# Altium schematic sheet adapter.SchDoc: DiPho_adapter
size 420 x 297 mm; Author: P.Daniel; CompanyName: WUT ISE; DrawnBy: P.Daniel; Organization: WUT ISE; Address1: PW ISE; Address2: Nowowiejska 15/19 00-665 Warsaw; Address3: piotrmaciejdaniel@gmail.com; Revision: 2; SheetNumber: 1; SheetTotal: 1; ModifiedBy: -; CheckedDate: -; Title2: adapter board for DiPho sensor; DivGrp: WUT ISE; Designer: Piotr Daniel; ModifiedDate: -; ProjectName: Sensor Box
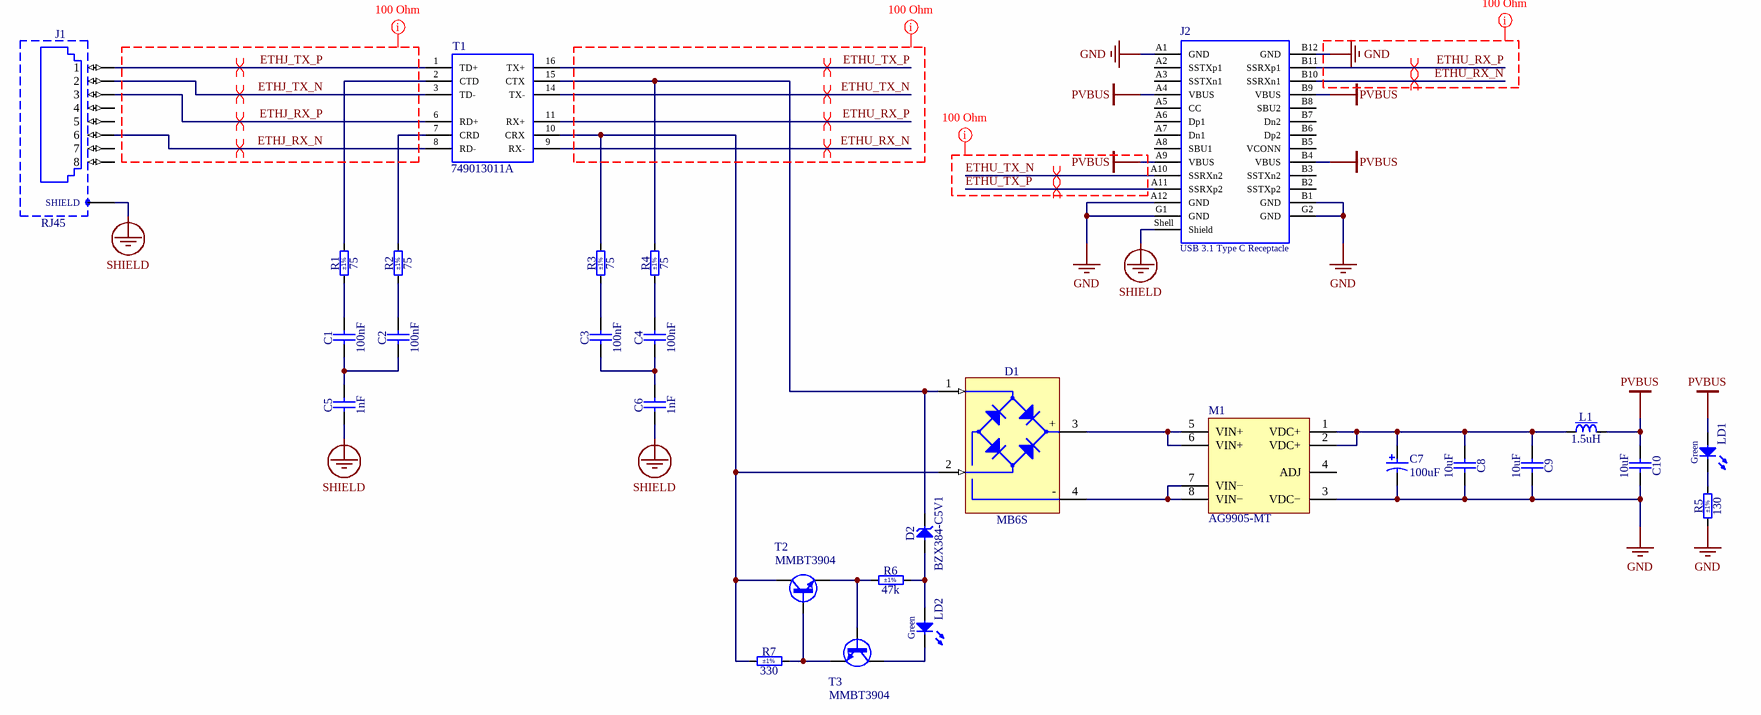
[diagram p0: adapter.SchDoc]

## Parts
C1  100nF  [CAPC1608X90N]
C2  100nF  [CAPC1608X90N]
C3  100nF  [CAPC1608X90N]
C4  100nF  [CAPC1608X90N]
C5  1nF  [CAPC3216X180N]
C6  1nF  [CAPC3216X180N]
C7  100uF  [PNSC-EEEFK1C101P_L]
C8  10uF  [CAPC3225X270N]
C9  10uF  [CAPC3225X270N]
C10  10uF  [CAPC3225X270N]
D1  MB6S  [SOIC254P665X290-4N]
D2  BZX384-C5V1  [SOD2512X110N]
J1  RJ45  [MOLEX_44661-1001]
J2  USB 3.1 Type C Receptacle  [632723300011]
L1  1.5uH  [IND_COILCRAFT_1812CS]
LD1  Green  [LED_LITEON_LTST-C193KGKT-5A]
LD2  Green  [LED_LITEON_LTST-C193KGKT-5A]
M1  AG9905-MT  [SILVERTEL_AG9900]
R1  75  Tolerance: ±1%  [RESC1608X55N]
R2  75  Tolerance: ±1%  [RESC1608X55N]
R3  75  Tolerance: ±1%  [RESC1608X55N]
R4  75  Tolerance: ±1%  [RESC1608X55N]
R5  130  Tolerance: ±1%  [RESC1608X55N]
R6  47k  Tolerance: ±1%  [RESC1608X55N]
R7  330  Tolerance: ±1%  [RESC1608X55N]
T1  749013011A  [749013011A]
T2  MMBT3904  [SOT95P230X110-3N]
T3  MMBT3904  [SOT95P230X110-3N]

## Nets
GND: C7.2 C8.2 C9.2 C10.2 J2.A1(GND) J2.A12(GND) J2.B1(GND) J2.B12(GND) J2.G1(GND) J2.G2(GND) M1.3(VDC−) R5.1
PVBUS: C10.1 J2.A4(VBUS) J2.A9(VBUS) J2.B4(VBUS) J2.B9(VBUS) L1.2 LD1.2(A)
SHIELD: C5.1 C6.1 J1.SHIELD J2.Shell(Shield)
ETHJ_RX_N: J1.6 T1.8(RD-)
ETHJ_RX_P: J1.3 T1.6(RD+)
ETHJ_TX_N: J1.2 T1.3(TD-)
ETHJ_TX_P: J1.1 T1.1(TD+)
ETHU_RX_N: J2.B10(SSRXn1) T1.9(RX-)
ETHU_RX_P: J2.B11(SSRXp1) T1.11(RX+)
ETHU_TX_N: J2.A10(SSRXn2) T1.14(TX-)
ETHU_TX_P: J2.A11(SSRXp2) T1.16(TX+)
NetC1_1: C1.1 C2.1 C5.2
NetC1_2: C1.2 R1.1
NetC2_2: C2.2 R2.1
NetC3_1: C3.1 C4.1 C6.2
NetC3_2: C3.2 R3.1
NetC4_2: C4.2 R4.1
NetC7_1: C7.1 C8.1 C9.1 L1.1 M1.1(VDC+) M1.2(VDC+)
NetD1_1: D1.1(AC) D2.1(C) R4.2 T1.15(CTX)
NetD1_2: D1.2(AC) R3.2 R7.1 T1.10(CRX) T2.3(C)
NetD1_3: D1.3(+) M1.5(VIN+) M1.6(VIN+)
NetD1_4: D1.4(-) M1.7(VIN−) M1.8(VIN−)
NetD2_2: D2.2(A) LD2.2(A) R6.2
NetLD1_1: LD1.1(C) R5.2
NetLD2_1: LD2.1(C) T3.3(C)
NetR1_2: R1.2 T1.2(CTD)
NetR2_2: R2.2 T1.7(CRD)
NetR6_1: R6.1 T2.2(E) T3.1(B)
NetR7_2: R7.2 T2.1(B) T3.2(E)

Not connected (* = marked no-connect by the designer): J1 4 5 7 8; J2 A2(SSTXp1) A3(SSTXn1) A5(CC) A6(Dp1) A7(Dn1) A8(SBU1) B2(SSTXp2) B3(SSTXn2) B5(VCONN) B6(Dp2) B7(Dn2) B8(SBU2); M1 4(ADJ)

## Layout directives
differential pair: ETHJ_RX_N, ETHJ_RX_P, ETHJ_TX_N, ETHJ_TX_P, ETHU_RX_N, ETHU_RX_P, ETHU_TX_N, ETHU_TX_P
rule Differential Pairs Routing [Pref Gap = 5mil    Min Gap  = 5mil    Max Gap  = 5milPref Width = 15mil    Min Width  = 15mil    Max Width  = 15mil]: ETHJ_RX_N, ETHJ_RX_P, ETHJ_TX_N, ETHJ_TX_P, ETHU_RX_N, ETHU_RX_P, ETHU_TX_N, ETHU_TX_P, GND, PVBUS

## Notes on the sheet
- Project/Equipment
- Document
- Designer
- Drawn by
- Check.by
- Copyright WUT ISE 2021.
  This documentation describes Open Hardware and is licensed under the CERN OHL v.1.1. You may redistribute and modify this documentation under the terms of the CERN OHL v.1.1. (http://ohwr.org/CERNOHL). This documentation is distributed WITHOUT ANY EXPRESS OR IMPLIED WARRANTY, INCLUDING OF MERCHANTABILITY, SATISFACTORY QUALITY AND FITNESS FOR A PARTICULAR PURPOSE. Please see the CERN OHL v.1.1 for applicable conditions.
- Contact
- File
- Last Mod.
- Print Date
- Sheet
- Size
- A3
- of
- Rev

## Library data of the parts
C1-C4 = CC0603_100NF_100V_10%_X7R: Non-polarised capacitor; Part Description: SMD Multilayer Chip Ceramic Capacitor; Manufacturer: GENERIC; Manufacturer1 Part Number: GRM188R72A104KA35D; Voltage: 100V; TC: X7R; Tolerance: ±10%; Part Number: CC0603_100NF_100V_10%_X7R; Component Kind: Standard; Component Type: Standard; Pin Count: 2; Value: 100nF; Status: None; Manufacturer Part Number: CC0603_100NF_100V_10%_X7R; Case: 0603; Mounted: Yes; Socket: No; SMD: Yes; Sense: No; Manufacturer1 Example: MURATA; Manufacturer1 ComponentHeight: 0.9mm; HelpURL: \\cern.ch\dfs\Applications\Altium\Datasheets\CC0603_MURATA_GRM188R72A104KA35D.pdf; Author: CERN DEM JLC; CreateDate: 11.12.2013; LatestRevisionDate: 11.12.2013
C5 C6 = CC1206_1NF_2KV_10%_X7R: Non-polarised capacitor; Part Description: High Voltage MLC Chip Capacitor; Manufacturer: GENERIC; Manufacturer1 Part Number: 1206GC102KAT2A; Voltage: 2kV; TC: X7R; Tolerance: ±10%; Part Number: CC1206_1NF_2KV_10%_X7R; Component Kind: Standard; Component Type: Standard; Pin Count: 2; Value: 1nF; Status: None; Manufacturer Part Number: CC1206_1NF_2KV_10%_X7R; Case: 1206; Mounted: Yes; Socket: No; SMD: Yes; Sense: No; Manufacturer1 Example: AVX; Manufacturer1 ComponentHeight: 1.8mm; HelpURL: \\cern.ch\dfs\Applications\Altium\Datasheets\CC1206_X7R_AVX_HV-MLC.pdf; Author: CERN DEM JLC; CreateDate: 19.11.2012; LatestRevisionDate: 17.05.2017
C7 = CMP-2000-06203-1: Aluminum Electrolytic Capacitor, 100 uF, 20%, 16 V, -55 to 105 degC, 2-Pin SMD, RoHS, Tape and Reel; Manufacturer: Panasonic; Lifetime@Temperature: 2000Hrs@105°C; Impedance: 0.36O; Ripple Current: 240mA; Rated Voltage: 16V; Type: Can; Capacitance: 100µF; Datasheet URL: http://datasheet.octopart.com/EEEFK1C101P-Panasonic-datasheet-13266987.pdf; Package Description: 2-Pin Surface Mount Device, Body 6.6 x 6.6 mm; Manufacturer URL: http://www.panasonic.com/; Case Size/Dimension: Ø6.3x5.8mm; Series: FK; Datasheet Version: 11/2012; Mounting Technology: SurfaceMount; Package Reference: EEEFK1C101P; Operating Temp-Max: 105°C; Operating Temp Range: -55to+105°C
C8-C10 = CC1210_10UF_25V_10%_X7R: Non-polarised capacitor; Part Description: SMD Multilayer Chip Ceramic Capacitor; Manufacturer: GENERIC; Manufacturer1 Part Number: C1210C106K4RACTU; Voltage: 25V; TC: X7R; Tolerance: ±10%; Part Number: CC1210_10UF_25V_10%_X7R; Component Kind: Standard; Component Type: Standard; Pin Count: 2; Value: 10uF; Status: None; Manufacturer Part Number: CC1210_10UF_25V_10%_X7R; Case: 1210; Mounted: Yes; Socket: No; SMD: Yes; Sense: No; Manufacturer1 Example: KEMET; Manufacturer1 ComponentHeight: 2.7mm; HelpURL: \\cern.ch\dfs\Applications\Altium\Datasheets\CC1210_X7R_KEMET.pdf; Author: CERN DEM JLC; CreateDate: 05.05.2009; LatestRevisionDate: 01.04.2010
D1 = MB6S: Bridge Rectifier 1AC 2AC 3+ 4-; Part Description: Miniature Glass Passivated Fast Recovery Surface Mount Bridge Rectifier; Manufacturer: VISHAY GENERAL SEMICONDUCTOR; Voltage: 600V; Power: 0.5A; PressFit: No; Bonding: No; Part Number: MB6S; Component Kind: Standard; Component Type: Standard; Device: MB6S; PackageDescription: SOIC, 4-Leads, Body 3.9x4.75mm, Pitch 2.54mm, IPC Medium Density; Manufacturer Part Number: MB6S; Pin Count: 4; Case: SOIC4; Mounted: Yes; Socket: No; SMD: Yes; Sense: No; ComponentHeight: 2.9mm; HelpURL: \\cern.ch\dfs\Applications\Altium\Datasheets\MB6S.pdf; Author: CERN DEM MR; CreateDate: 15.04.2016; LatestRevisionDate: 15.04.2016
D2 = BZX384-C5V1: Zener Diode; Part Description: Zener Voltage Regulator; Manufacturer: NEXPERIA; Voltage: 5.1V; Power: 300mW; PressFit: No; Bonding: No; Part Number: BZX384-C5V1; Component Kind: Standard; Component Type: Standard; Device: BZX384-C5V1; PackageDescription: Small Outline Diode (SOD-323), 1.70mm W X 1.25mm L X 1.10mm H body,  IPC Medium Density; Manufacturer Part Number: BZX384-C5V1; Pin Count: 2; Case: SOD-323; Mounted: Yes; Socket: No; SMD: Yes; Sense: No; ComponentHeight: 1.1mm; HelpURL: \\cern.ch\dfs\Applications\Altium\Datasheets\BZX384.pdf; Author: CERN DEM MR; CreateDate: 24.07.2018; LatestRevisionDate: 24.07.2018
J1 = MOLEX_44661-1001: Connector RJ45 + Shield; Part Description: 8 Contacts, 1.27mm Pitch, Through Hole Right Angle Magnetic and Modular Jack 8/8, Low Profile, Cat. 5 RJ45; Manufacturer: MOLEX; PressFit: No; Part Number: MOLEX_44661-1001; Component Kind: Standard; Component Type: Standard; Pin Count: 8; Family: RJ45; Mounted: Yes; Socket: No; SMD: No; Sense: No; Status: None; Manufacturer Part Number: 44661-1001; ComponentHeight: 9.53mm; HelpURL: \\cern.ch\dfs\Applications\Altium\Datasheets\MOLEX_44661-1001.pdf; Author: CERN DEM BC; CreateDate: 22.02.2021; LatestRevisionDate: 22.02.2021
J2 = 632723300011: USB 3.1 Type C, Receptacle, Horizontal, THR; Manufacturer: Wurth Elektronik; Rated Current: 5A; Pin Number: 24; Interface Type: Type C; Working Voltage: 20VAC; ComponentLink1Description: Manufacturer; ComponentLink1URL: http://www.we-online.de; ComponentLink2Description: Datasheet; ComponentLink2URL: https://katalog.we-online.com/em/datasheet/632723300011.pdf; Published Date: August 2020; Manufacturer Part Number: 632723300011; Gender: Receptacle; Type: Horizontal; Packaging: Tape and Reel; Operating Temperature: -40 to +105degC; Mounting Technology: THR; Application: USB 3.1
L1 = IND_1.5UH_2%_COILCRAFT_1812CS: Inductor With Core; Part Description: SMT Chip Inductor; Manufacturer Part Number: 1812CS-152XGL; Power: 430mA; Resistance: 1.6R; Tolerance: ±2%; Part Number: IND_1.5UH_2%_COILCRAFT_1812CS; Component Kind: Standard; Component Type: Standard; Pin Count: 2; Value: 1.5uH; Status: None; Manufacturer: COILCRAFT; Case: 1812; Mounted: Yes; Socket: No; SMD: Yes; Sense: No; ComponentHeight: 3.43mm; HelpURL: \\cern.ch\dfs\Applications\Altium\Datasheets\IND_COILCRAFT_1812CS.pdf; Author: CERN DEM JMW; CreateDate: 26.10.2015; LatestRevisionDate: 26.10.2015
LD1 LD2 = LED_LITEON_LTST-C193KGKT-5A: LED Green 1C 2A; Part Description: Extra Thin SMD Chip LED, Ultra Bright AlInGaP Green, Lens Water Clear; Manufacturer: LITE-ON SEMICONDUCTOR; PressFit: No; Bonding: No; Part Number: LED_LITEON_LTST-C193KGKT-5A; Component Kind: Standard; Component Type: Standard; Color: Green; PackageDescription: SMD AlInGaP Green LED, Lens Water Clear, 2-Leads, Body 1.6x0.8mm; Manufacturer Part Number: LTST-C193KGKT-5A; Pin Count: 2; Case: 0603; Mounted: Yes; Socket: No; SMD: Yes; Sense: No; ComponentHeight: 0.35mm; HelpURL: \\cern.ch\dfs\Applications\Altium\Datasheets\LED_LITEON_LTST-C193KGKT-5A.pdf; Author: CERN DEM BC; CreateDate: 11.11.2020; LatestRevisionDate: 11.11.2020
M1 = AG9905-MT: Ultra Miniature PoE, 5V, w/Thermal Protection; Manufacturer: Silvertel; Supplier 1: Mouser; Manufacturer Part Number: AG9905-MT; RoHS: No; Pricing 1: 1=8,19000, 10=8,13000, 20=7,75000, 50=7,75000, 100=7,14000, 1000=7,14000, 10000=7,14000 (USD); Supplier Part Number 1: 480-AG9905MT
R1-R4 = R0603_75R_1%_0.1W_100PPM: Resistor - 1%; Part Description: General Purpose Thick Film Chip Resistor; Manufacturer: GENERIC; Manufacturer1 Part Number: NRC06F75R0TRF; Power: 0.1W; TC: ±100ppm/°C; PressFit: No; Part Number: R0603_75R_1%_0.1W_100PPM; Component Kind: Standard; Component Type: Standard; Pin Count: 2; Value: 75; Status: Preferred; Manufacturer Part Number: R0603_75R_1%_0.1W_100PPM; Case: 0603; Mounted: Yes; Sense: No; Socket: No; SMD: Yes; Manufacturer1 Example: NIC COMPONENT; Manufacturer1 ComponentHeight: 0.55mm; HelpURL: \\cern.ch\dfs\Applications\Altium\Datasheets\R0603_NIC_NRC.pdf; Author: CERN DEM JLC; CreateDate: 03.12.2007; LatestRevisionDate: 13.03.2008
R5 = R0603_130R_1%_0.1W_100PPM: Resistor - 1%; Part Description: General Purpose Thick Film Chip Resistor; Manufacturer: GENERIC; Manufacturer1 Part Number: NRC06F1300TRF; Power: 0.1W; TC: ±100ppm/°C; PressFit: No; Part Number: R0603_130R_1%_0.1W_100PPM; Component Kind: Standard; Component Type: Standard; Pin Count: 2; Value: 130; Status: Preferred; Manufacturer Part Number: R0603_130R_1%_0.1W_100PPM; Case: 0603; Mounted: Yes; Sense: No; Socket: No; SMD: Yes; Manufacturer1 Example: NIC COMPONENT; Manufacturer1 ComponentHeight: 0.55mm; HelpURL: \\cern.ch\dfs\Applications\Altium\Datasheets\R0603_NIC_NRC.pdf; Author: CERN DEM JLC; CreateDate: 03.12.2007; LatestRevisionDate: 13.03.2008
R6 = R0603_47K_1%_0.1W_100PPM: Resistor - 1%; Part Description: General Purpose Thick Film Chip Resistor; Manufacturer: GENERIC; Manufacturer1 Part Number: NRC06F4702TRF; Power: 0.1W; TC: ±100ppm/°C; PressFit: No; Part Number: R0603_47K_1%_0.1W_100PPM; Component Kind: Standard; Component Type: Standard; Pin Count: 2; Value: 47k; Status: Preferred; Manufacturer Part Number: R0603_47K_1%_0.1W_100PPM; Case: 0603; Mounted: Yes; Sense: No; Socket: No; SMD: Yes; Manufacturer1 Example: NIC COMPONENT; Manufacturer1 ComponentHeight: 0.55mm; HelpURL: \\cern.ch\dfs\Applications\Altium\Datasheets\R0603_NIC_NRC.pdf; Author: CERN DEM JLC; CreateDate: 03.12.2007; LatestRevisionDate: 13.03.2008
R7 = R0603_330R_1%_0.1W_100PPM: Resistor - 1%; Part Description: General Purpose Thick Film Chip Resistor; Manufacturer: GENERIC; Manufacturer1 Part Number: NRC06F3300TRF; Power: 0.1W; TC: ±100ppm/°C; PressFit: No; Part Number: R0603_330R_1%_0.1W_100PPM; Component Kind: Standard; Component Type: Standard; Pin Count: 2; Value: 330; Status: Preferred; Manufacturer Part Number: R0603_330R_1%_0.1W_100PPM; Case: 0603; Mounted: Yes; Sense: No; Socket: No; SMD: Yes; Manufacturer1 Example: NIC COMPONENT; Manufacturer1 ComponentHeight: 0.55mm; HelpURL: \\cern.ch\dfs\Applications\Altium\Datasheets\R0603_NIC_NRC.pdf; Author: CERN DEM JLC; CreateDate: 03.12.2007; LatestRevisionDate: 13.03.2008
T1 = 749013011A: WE-LAN LAN Transformer, SMT, 10/100 Base-T, 1 port; Manufacturer: Wurth Elektronik; PoE Current: 350mA; Turns Ratio: 1:1; HPLE: No; Number of Ports: 1; Inductance: 350uH; Insulation Test Voltage: 1500Vrms; ComponentLink1Description: Manufacturer; ComponentLink1URL: http://www.we-online.de; ComponentLink2Description: Datasheet; ComponentLink2URL: https://www.we-online.com/catalog/datasheet/749013011A.pdf; Operating Temperature: -40 to +105degC; Published Date: March 2020; Manufacturer Part Number: 749013011A; Packaging: Tape and Reel; Data Rate: 10/100 Base-T; Mounting Technology: SMT
T2 T3 = MMBT3904: NPN Transistor; Part Description: 40V 200mA NPN Switching Transistor; Manufacturer: NXP SEMICONDUCTORS; PressFit: No; Bonding: No; Part Number: MMBT3904; Component Kind: Standard; Component Type: Standard; Device: MMBT3904; PackageDescription: SOT23, 0.95mm Pitch; 3 Pin, 1.30mm W X 2.90mm L X 1.10mm H body, IPC Medium Density; Manufacturer Part Number: MMBT3904; Pin Count: 3; Case: SOT23-3; Mounted: Yes; Socket: No; SMD: Yes; Sense: No; ComponentHeight: 1.1mm; HelpURL: \\cern.ch\dfs\Applications\Altium\Datasheets\MMBT3904.pdf; Author: CERN DEM JLC; CreateDate: 10.02.2010; LatestRevisionDate: 10.02.2010